# EAGLE design wemos-board (EAGLE 9.5.2)
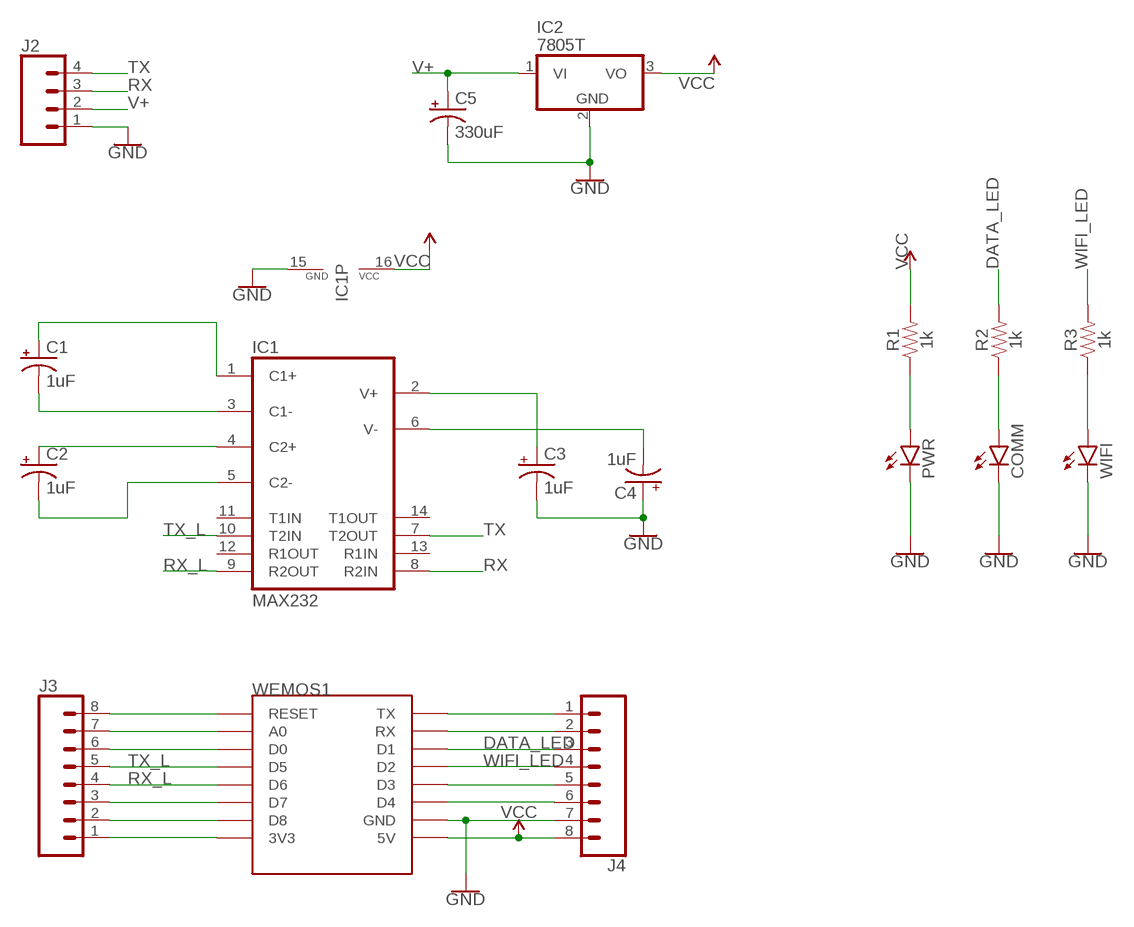
[diagram p0: schematic, sheet 1]

## Parts
C1  1uF  100UF-POLAR-RADIAL-2.5MM-25V-20%  [CPOL-RADIAL-2.5MM-6.5MM]
C2  1uF  100UF-POLAR-RADIAL-2.5MM-25V-20%  [CPOL-RADIAL-2.5MM-6.5MM]
C3  1uF  100UF-POLAR-RADIAL-2.5MM-25V-20%  [CPOL-RADIAL-2.5MM-6.5MM]
C4  1uF  100UF-POLAR-RADIAL-2.5MM-25V-20%  [CPOL-RADIAL-2.5MM-6.5MM]
C5  330uF  100UF-POLAR-RADIAL-2.5MM-25V-20%  [CPOL-RADIAL-2.5MM-6.5MM]
COMM  LED3MM  [LED3MM]
IC1  MAX232  [DIL16]
IC2  7805T  [TO220H]
J2  CONN_04  [1X04]
J3  CONN_08"  [1X08]
J4  CONN_08"  [1X08]
PWR  LED3MM  [LED3MM]
R1  1k  1KOHM-HORIZ_KIT-1/4W-5%  [AXIAL-0.3-KIT]
R2  1k  1KOHM-HORIZ_KIT-1/4W-5%  [AXIAL-0.3-KIT]
R3  1k  1KOHM-HORIZ_KIT-1/4W-5%  [AXIAL-0.3-KIT]
WEMOS1  WEMOS-D1-MINI  [WEMOS-D1-MINI]
WIFI  LED3MM  [LED3MM]

## Nets
DATA_LED: J4.3 R2.P$2 WEMOS1.D1
GND: C3.2(-) C4.1(+) C5.2(-) COMM.K(C) IC1.15(GND) IC2.2(GND) J2.1 J4.7 PWR.K(C) WEMOS1.GND WIFI.K(C)
N$1: C1.1(+) IC1.1(C1+)
N$2: C1.2(-) IC1.3(C1-)
N$3: C2.1(+) IC1.4(C2+)
N$4: C2.2(-) IC1.5(C2-)
N$5: C3.1(+) IC1.2(V+)
N$6: C4.2(-) IC1.6(V-)
N$7: J3.8 WEMOS1.RESET
N$8: J3.7 WEMOS1.A0
N$9: J3.6 WEMOS1.D0
N$10: J3.3 WEMOS1.D7
N$11: J3.2 WEMOS1.D8
N$12: J3.1 WEMOS1.3V3
N$13: J4.1 WEMOS1.TX
N$14: J4.2 WEMOS1.RX
N$17: J4.5 WEMOS1.D3
N$18: J4.6 WEMOS1.D4
N$19: PWR.A R1.P$1
N$20: COMM.A R2.P$1
N$21: R3.P$1 WIFI.A
RX: IC1.8(R2IN) J2.3
RX_L: IC1.9(R2OUT) J3.4 WEMOS1.D6
TX: IC1.7(T2OUT) J2.4
TX_L: IC1.10(T2IN) J3.5 WEMOS1.D5
V+: C5.1(+) IC2.1(VI) J2.2
VCC: IC1.16(VCC) IC2.3(VO) J4.8 R1.P$2 WEMOS1.5V
WIFI_LED: J4.4 R3.P$2 WEMOS1.D2
Unconnected: IC1.11(T1IN) IC1.12(R1OUT) IC1.13(R1IN) IC1.14(T1OUT)

## Library data of the parts
C1-C5 = SparkFun-Capacitors:100UF-POLAR: 100µF polarized capacitors A capacitor is a passive two-terminal electrical component used to store electrical energy temporarily in an electric field.; PROD_ID: CAP-08439; VALUE: 100uF
COMM PWR WIFI = led:LED: LED OSRAM: - CHIPLED LG R971, LG N971, LY N971, LG Q971, LY Q971, LO R971, LY R971 LH N974, LH R974 LS Q976, LO Q976, LY Q976 LO Q996 - Hyper CHIPLED LW Q18S LB Q993, LB Q99A, LB R99A - SideLED LS A670, LO A670, LY A670, LG A670, LP A670 LB A673, LV A673, LT A673, LW A673 LH A674 LY A675 LS A676, LA A676, LO A676, LY A676, LW A676 LS A679, LY A679, LG A679 - Hyper Micro SIDELED® LS Y876, LA Y876, LO Y876, LY Y876 LT Y87S - SmartLED LW L88C, LW L88S LB L89C, LB L89S, LG L890 LS L89K, LO L89K, LY L89K LS L896, LA L896, LO L896, LY L896 - TOPLED LS T670, LO T670, LY T670, LG T670, LP T670 LSG T670, LSP T670, LSY T670, LOP T670, LYG T670 LG T671, LOG T671, LSG T671 LB T673, LV T673, LT T673, LW T673 LH T674 LS T676, LA T676, LO T676, LY T676, LB T676, LH T676, LSB T676, LW T676 LB T67C, LV T67C, LT T67C, LS T67K, LO T67K, LY T67K, LW E67C LS E67B, LA E67B, LO E67B, LY E67B, LB E67C, LV E67C, LT E67C LW T67C LS T679, LY T679, LG T679 LS T770, LO T770, LY T770, LG T770, LP T770 LB T773, LV T773, LT T773, LW T773 LH T774 LS E675, LA E675, LY E675, LS T675 LS T776, LA T776, LO T776, LY T776, LB T776 LHGB T686 LT T68C, LB T68C - Hyper Mini TOPLED® LB M676 - Mini TOPLED Santana® LG M470 LS M47K, LO M47K, LY M47K Source: http://www.osram.convergy.de LUXEON: - LUMILED® LXK2-PW12-R00, LXK2-PW12-S00, LXK2-PW14-U00, LXK2-PW14-V00 LXK2-PM12-R00, LXK2-PM12-S00, LXK2-PM14-U00 LXK2-PE12-Q00, LXK2-PE12-R00, LXK2-PE12-S00, LXK2-PE14-T00, LXK2-PE14-U00 LXK2-PB12-K00, LXK2-PB12-L00, LXK2-PB12-M00, LXK2-PB14-N00, LXK2-PB14-P00, LXK2-PB14-Q00 LXK2-PR12-L00, LXK2-PR12-M00, LXK2-PR14-Q00, LXK2-PR14-R00 LXK2-PD12-Q00, LXK2-PD12-R00, LXK2-PD12-S00 LXK2-PH12-R00, LXK2-PH12-S00 LXK2-PL12-P00, LXK2-PL12-Q00, LXK2-PL12-R00 Source: www.luxeon.com KINGBRIGHT: KA-3528ASYC Source: www.kingbright.com
IC1 = maxim:MAX232: RS232 TRANSCEIVER; MF: MAXIM; MPN: MAX232ACPE+; OC_FARNELL: 9723773; OC_NEWARK: 68K4544
IC2 = linear:78*: Positive VOLTAGE REGULATOR Source: http://cache.national.com/ds/LM/LM78L05.pdf http://www.fairchildsemi.com/ds/LM/LM7805.pdf
J2 = SparkFun-Connectors:CONN_04: Multi connection point. Often used as Generic Header-pin footprint for 0.1 inch spaced/style header connections On any of the 0.1 inch spaced packages, you can populate with these: Break Away Headers - Straight <https://www.sparkfun.com/products/116> (PRT-00116) Break Away Male Headers - Right Angle <https://www.sparkfun.com/products/553> (PRT-00553) Female Headers <https://www.sparkfun.com/products/115> (PRT-00115) Break Away Headers - Machine Pin <https://www.sparkfun.com/products/117> (PRT-00117) Break Away Female Headers - Swiss Machine Pin <https://www.sparkfun.com/products/743> (PRT-00743) For SCREWTERMINALS and SPRING TERMINALS visit here: Screw Terimnals on SparkFun.com <https://www.sparkfun.com/search/results?term=Screw+Terminals> (5mm/3.5mm/2.54mm spacing) This device is also useful as a general connection point to wire up your design to another part of your project. Our various solder wires solder well into these plated through hole pads. Hook-Up Wire - Assortment (Stranded, 22 AWG) <https://www.sparkfun.com/products/11375> (PRT-11375) Hook-Up Wire - Assortment (Solid Core, 22 AWG) <https://www.sparkfun.com/products/11367> (PRT-11367) View the entire wire category on our website here <https://www.sparkfun.com/categories/141> Special notes: Molex polarized connector foot print use with SKU : PRT-08231 with associated crimp pins and housings. 1MM SMD Version SKU: PRT-10208; PROD_ID: CONN-09696
J3 J4 = SparkFun-Connectors:CONN_08: Multi connection point. Often used as Generic Header-pin footprint for 0.1 inch spaced/style header connections On any of the 0.1 inch spaced packages, you can populate with these: Break Away Headers - Straight <https://www.sparkfun.com/products/116> (PRT-00116) Break Away Male Headers - Right Angle <https://www.sparkfun.com/products/553> (PRT-00553) Female Headers <https://www.sparkfun.com/products/115> (PRT-00115) Break Away Headers - Machine Pin <https://www.sparkfun.com/products/117> (PRT-00117) Break Away Female Headers - Swiss Machine Pin <https://www.sparkfun.com/products/743> (PRT-00743) Arduino Stackable Header - 8 Pin <https://www.sparkfun.com/products/9279> (PRT-09279) For SCREWTERMINALS and SPRING TERMINALS visit here: Screw Terimnals on SparkFun.com <https://www.sparkfun.com/search/results?term=Screw+Terminals> (5mm/3.5mm/2.54mm spacing) This device is also useful as a general connection point to wire up your design to another part of your project. Our various solder wires solder well into these plated through hole pads. Hook-Up Wire - Assortment (Stranded, 22 AWG) <https://www.sparkfun.com/products/11375> (PRT-11375) Hook-Up Wire - Assortment (Solid Core, 22 AWG) <https://www.sparkfun.com/products/11367> (PRT-11367) View the entire wire category on our website here <https://www.sparkfun.com/categories/141> Special notes: Molex polarized connector foot print use with SKU : PRT-08231 with associated crimp pins and housings. 1MM SMD Version SKU: PRT-10208 NOTES ON THE VARIANTS LOCK and LOCK_LONGPADS... This footprint was designed to help hold the alignment of a through-hole component (i.e. 6-pin header) while soldering it into place. You may notice that each hole has been shifted either up or down by 0.005 of an inch from it's more standard position (which is a perfectly straight line). This slight alteration caused the pins (the squares in the middle) to touch the edges of the holes. Because they are alternating, it causes a "brace" to hold the component in place. 0.005 has proven to be the perfect amount of "off-center" position when using our standard breakaway headers. Although looks a little odd when you look at the bare footprint, once you have a header in there, the alteration is very hard to notice. Also,if you push a header all the way into place, it is covered up entirely on the bottom side.; PROD_ID: CONN-08438
R1-R3 = SparkFun-Resistors:1KOHM: 1kΩ resistor A resistor is a passive two-terminal electrical component that implements electrical resistance as a circuit element. Resistors act to reduce current flow, and, at the same time, act to lower voltage levels within circuits. - Wikipedia; PROD_ID: RES-08380
WEMOS1 = esp8266modules:WEMOS-D1-MINI: WeMos.cc D1 mini ESP8266 module

## Board
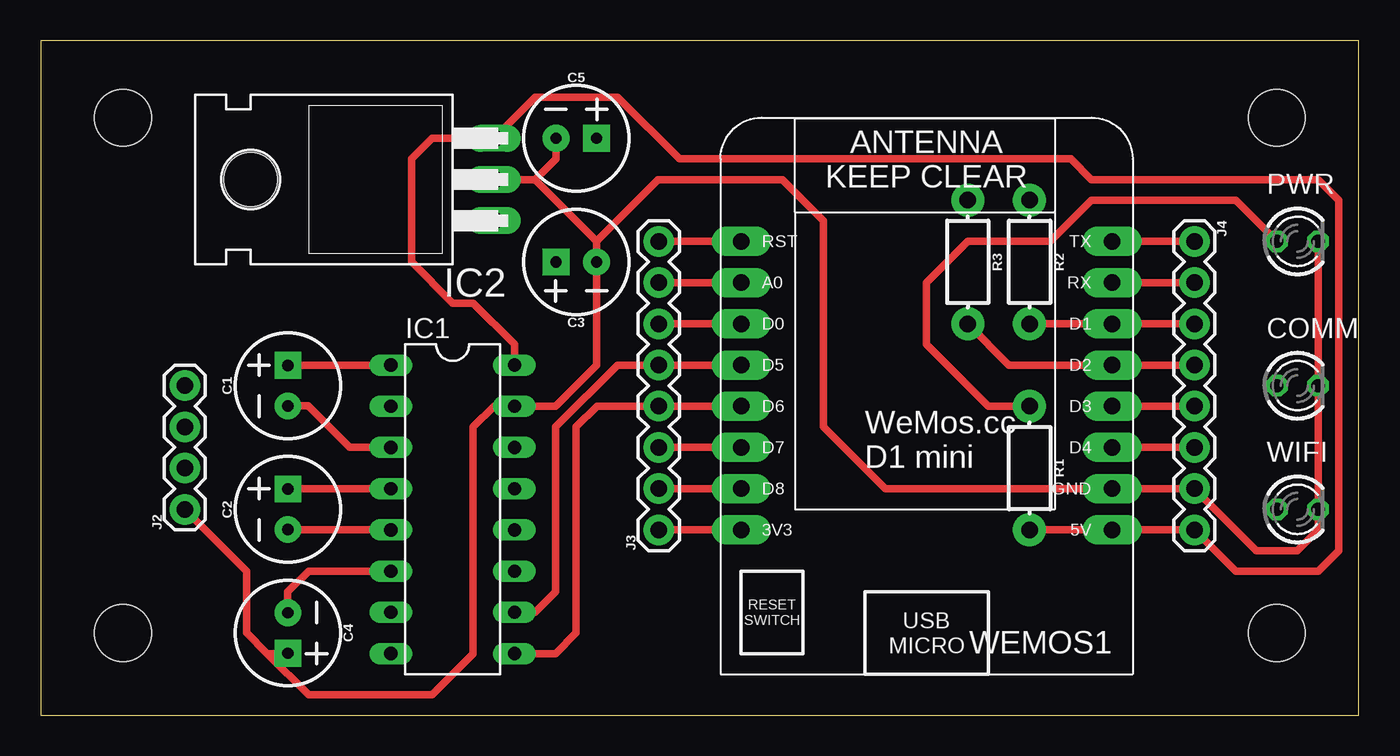
[diagram p1: board, top side]
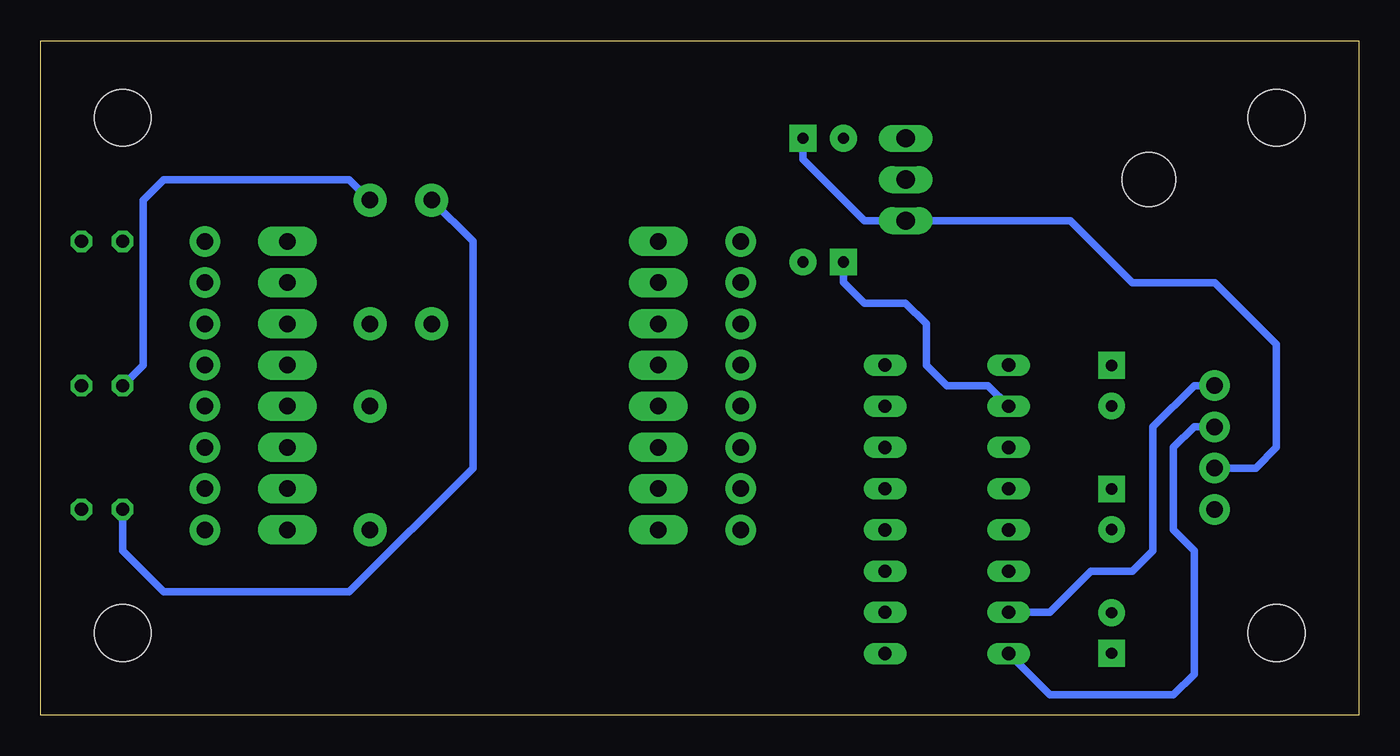
[diagram p2: board, bottom side, seen from below]

Size 81.26 x 41.58 mm. Coordinates in mm from the lower left corner, seen from the top.
Outline: 0,0 81.26,0 81.26,41.58 0,41.58 0,0
Copper layers (1*16): Top 0.035mm / dielectric 1.5mm / Bottom 0.035mm
Design rules "default": minimum track width 6mil, minimum drill 0.35mm, track to track 6mil, track to pad 6mil, pad to pad 6mil, via to via 6mil, smd to smd 6mil, copper to edge 40mil, drill to drill 6mil, minimum pad ring 10mil, minimum via ring 8mil, stop-mask expansion 4mil, vias tented up to drill 0mil, thermal gap 10mil
Holes 3.48 mm at 5.08,5.08 76.2,36.83 76.2,5.08 5.08,36.83

### Footprints (pad centres in the part's own frame; a part is rotated, then mirrored left to right if it is on the bottom)
CPOL-RADIAL-2.5MM-6.5MM = drill 0.7 pad 1.651 square: 1 1.25,0 | drill 0.7 pad 1.651: 2 -1.25,0
LED3MM = drill 0.813 octagon: A -1.27,0; K 1.27,0
DIL16 = drill 0.813 long: 1 -8.89,-3.81; 2 -6.35,-3.81; 3 -3.81,-3.81; 4 -1.27,-3.81; 5 1.27,-3.81; 6 3.81,-3.81; 7 6.35,-3.81; 8 8.89,-3.81; 9 8.89,3.81; 10 6.35,3.81; 11 3.81,3.81; 12 1.27,3.81; 13 -1.27,3.81; 14 -3.81,3.81; 15 -6.35,3.81; 16 -8.89,3.81
TO220H = drill 1.118 long: 1 -2.54,-10.16; 2 0,-10.16; 3 2.54,-10.16 | hole 3.302: 0,4.826
1X04 = drill 1.016 pad 1.88: 1 0,0; 2 2.54,0; 3 5.08,0; 4 7.62,0
1X08 = drill 1.016 pad 1.88: 1 0,0; 2 2.54,0; 3 5.08,0; 4 7.62,0; 5 10.16,0; 6 12.7,0; 7 15.24,0; 8 17.78,0
AXIAL-0.3-KIT = drill 1.016 pad 2.032: P$1 -3.81,0; P$2 3.81,0
WEMOS-D1-MINI = drill 1.016 pad 1.829 long: 3V3 -10.16,-10.16; 5V 12.7,-10.16; A0 -10.16,5.08; D0 -10.16,2.54; D1 12.7,2.54; D2 12.7,0; D3 12.7,-2.54; D4 12.7,-5.08; D5 -10.16,0; D6 -10.16,-2.54; D7 -10.16,-5.08; D8 -10.16,-7.62; GND 12.7,-7.62; RESET -10.16,7.62; RX 12.7,5.08; TX 12.7,7.62

### Placement (x,y rotation side)
C1  15.24,20.32 90 top
C2  15.24,12.7 90 top
C3  33.02,27.94 180 top
C4  15.24,5.08 270 top
C5  33.02,35.56 0 top
COMM  77.47,20.32 0 top
IC1  25.4,12.7 270 top
IC2  17.78,33.02 90 top
J2  8.89,12.7 90 top
J3  38.1,11.43 90 top
J4  71.12,29.21 270 top
PWR  77.47,29.21 0 top
R1  60.96,15.24 270 top
R2  60.96,27.94 270 top
R3  57.15,27.94 270 top
WEMOS1  53.34,21.59 0 top
WIFI  77.47,12.7 0 top

### Tracks (layer width: path | path; a pad name or v marks a point on that pad's centre or on a via)
DATA_LED
  Top 0.457: J4.3 WEMOS1.D1 R2.P$2
GND
  Top 0.457: C5.2 31.77,34.31 30.48,33.02 | IC2.2 30.48,33.02 | 34.27,29.23 C3.2 34.27,21.57 31.75,19.05 IC1.15 27.94,19.05 26.67,17.78 26.67,3.81 24.13,1.27 16.51,1.27 13.97,3.81 | 34.27,29.23 30.48,33.02 | J2.1 12.7,8.89 12.7,5.08 13.97,3.81 | 13.97,3.81 15.22,3.81 C4.1 | PWR.K COMM.K WIFI.K 78.74,11.43 77.47,10.16 74.93,10.16 J4.7 WEMOS1.GND 52.07,13.97 48.26,17.78 48.26,30.48 45.72,33.02 38.06,33.02 34.27,29.23
N$1
  Top 0.457: IC1.1 15.26,21.59 C1.1
N$2
  Top 0.457: IC1.3 19.05,16.51 16.49,19.07 C1.2
N$3
  Top 0.457: C2.1 15.26,13.97 IC1.4
N$4
  Top 0.457: IC1.5 15.26,11.43 C2.2
N$5
  Bottom 0.457: IC1.2 22.86,20.32 25.4,20.32 26.67,21.59 26.67,24.13 27.94,25.4 30.48,25.4 31.77,26.69 C3.1
N$6
  Top 0.457: C4.2 15.24,7.62 16.51,8.89 IC1.6
N$7
  Top 0.457: J3.8 WEMOS1.RESET
N$8
  Top 0.457: J3.7 WEMOS1.A0
N$9
  Top 0.457: J3.6 WEMOS1.D0
N$10
  Top 0.457: J3.3 WEMOS1.D7
N$11
  Top 0.457: J3.2 WEMOS1.D8
N$12
  Top 0.457: J3.1 WEMOS1.3V3
N$13
  Top 0.457: WEMOS1.TX J4.1
N$14
  Top 0.457: WEMOS1.RX J4.2
N$17
  Top 0.457: J4.5 WEMOS1.D3
N$18
  Top 0.457: WEMOS1.D4 J4.6
N$19
  Top 0.457: R1.P$1 58.42,19.05 54.61,22.86 54.61,26.67 57.15,29.21 62.23,29.21 64.77,31.75 73.66,31.75 PWR.A
N$20
  Bottom 0.457: COMM.A 74.93,21.59 74.93,31.75 73.66,33.02 62.23,33.02 R2.P$1
N$21
  Bottom 0.457: R3.P$1 54.61,29.21 54.61,15.24 62.23,7.62 73.66,7.62 76.2,10.16 WIFI.A
RX
  Bottom 0.457: J2.3 10.16,17.78 11.43,16.51 11.43,11.43 10.16,10.16 10.16,2.54 11.43,1.27 19.05,1.27 IC1.8
RX_L
  Top 0.457: WEMOS1.D6 J3.4 34.29,19.05 33.02,17.78 33.02,5.08 31.75,3.81 IC1.9
TX
  Bottom 0.457: IC1.7 19.05,6.35 16.51,8.89 13.97,8.89 12.7,10.16 12.7,17.78 10.16,20.32 J2.4
TX_L
  Top 0.457: WEMOS1.D5 J3.5 35.56,21.59 31.75,17.78 31.75,7.62 30.48,6.35 IC1.10
V+
  Bottom 0.457: C5.1 34.27,34.27 30.48,30.48 IC2.1 17.78,30.48 13.97,26.67 8.89,26.67 5.08,22.86 5.08,16.51 6.35,15.24 J2.2
VCC
  Top 0.457: IC1.16 29.21,22.86 26.67,25.4 25.4,25.4 22.86,27.94 22.86,34.29 24.13,35.56 IC2.3 30.48,38.1 35.56,38.1 39.37,34.29 63.5,34.29 64.77,33.02 78.74,33.02 80.01,31.75 80.01,10.16 78.74,8.89 73.66,8.89 J4.8 WEMOS1.5V R1.P$2
WIFI_LED
  Top 0.457: J4.4 WEMOS1.D2 59.69,21.59 R3.P$2